# Altium schematic sheet XMOS_chip.SchDoc
size Tabloid; DocumentNumber: 5; SheetNumber: 5; SheetTotal: 11; SheetName: XMOS processor
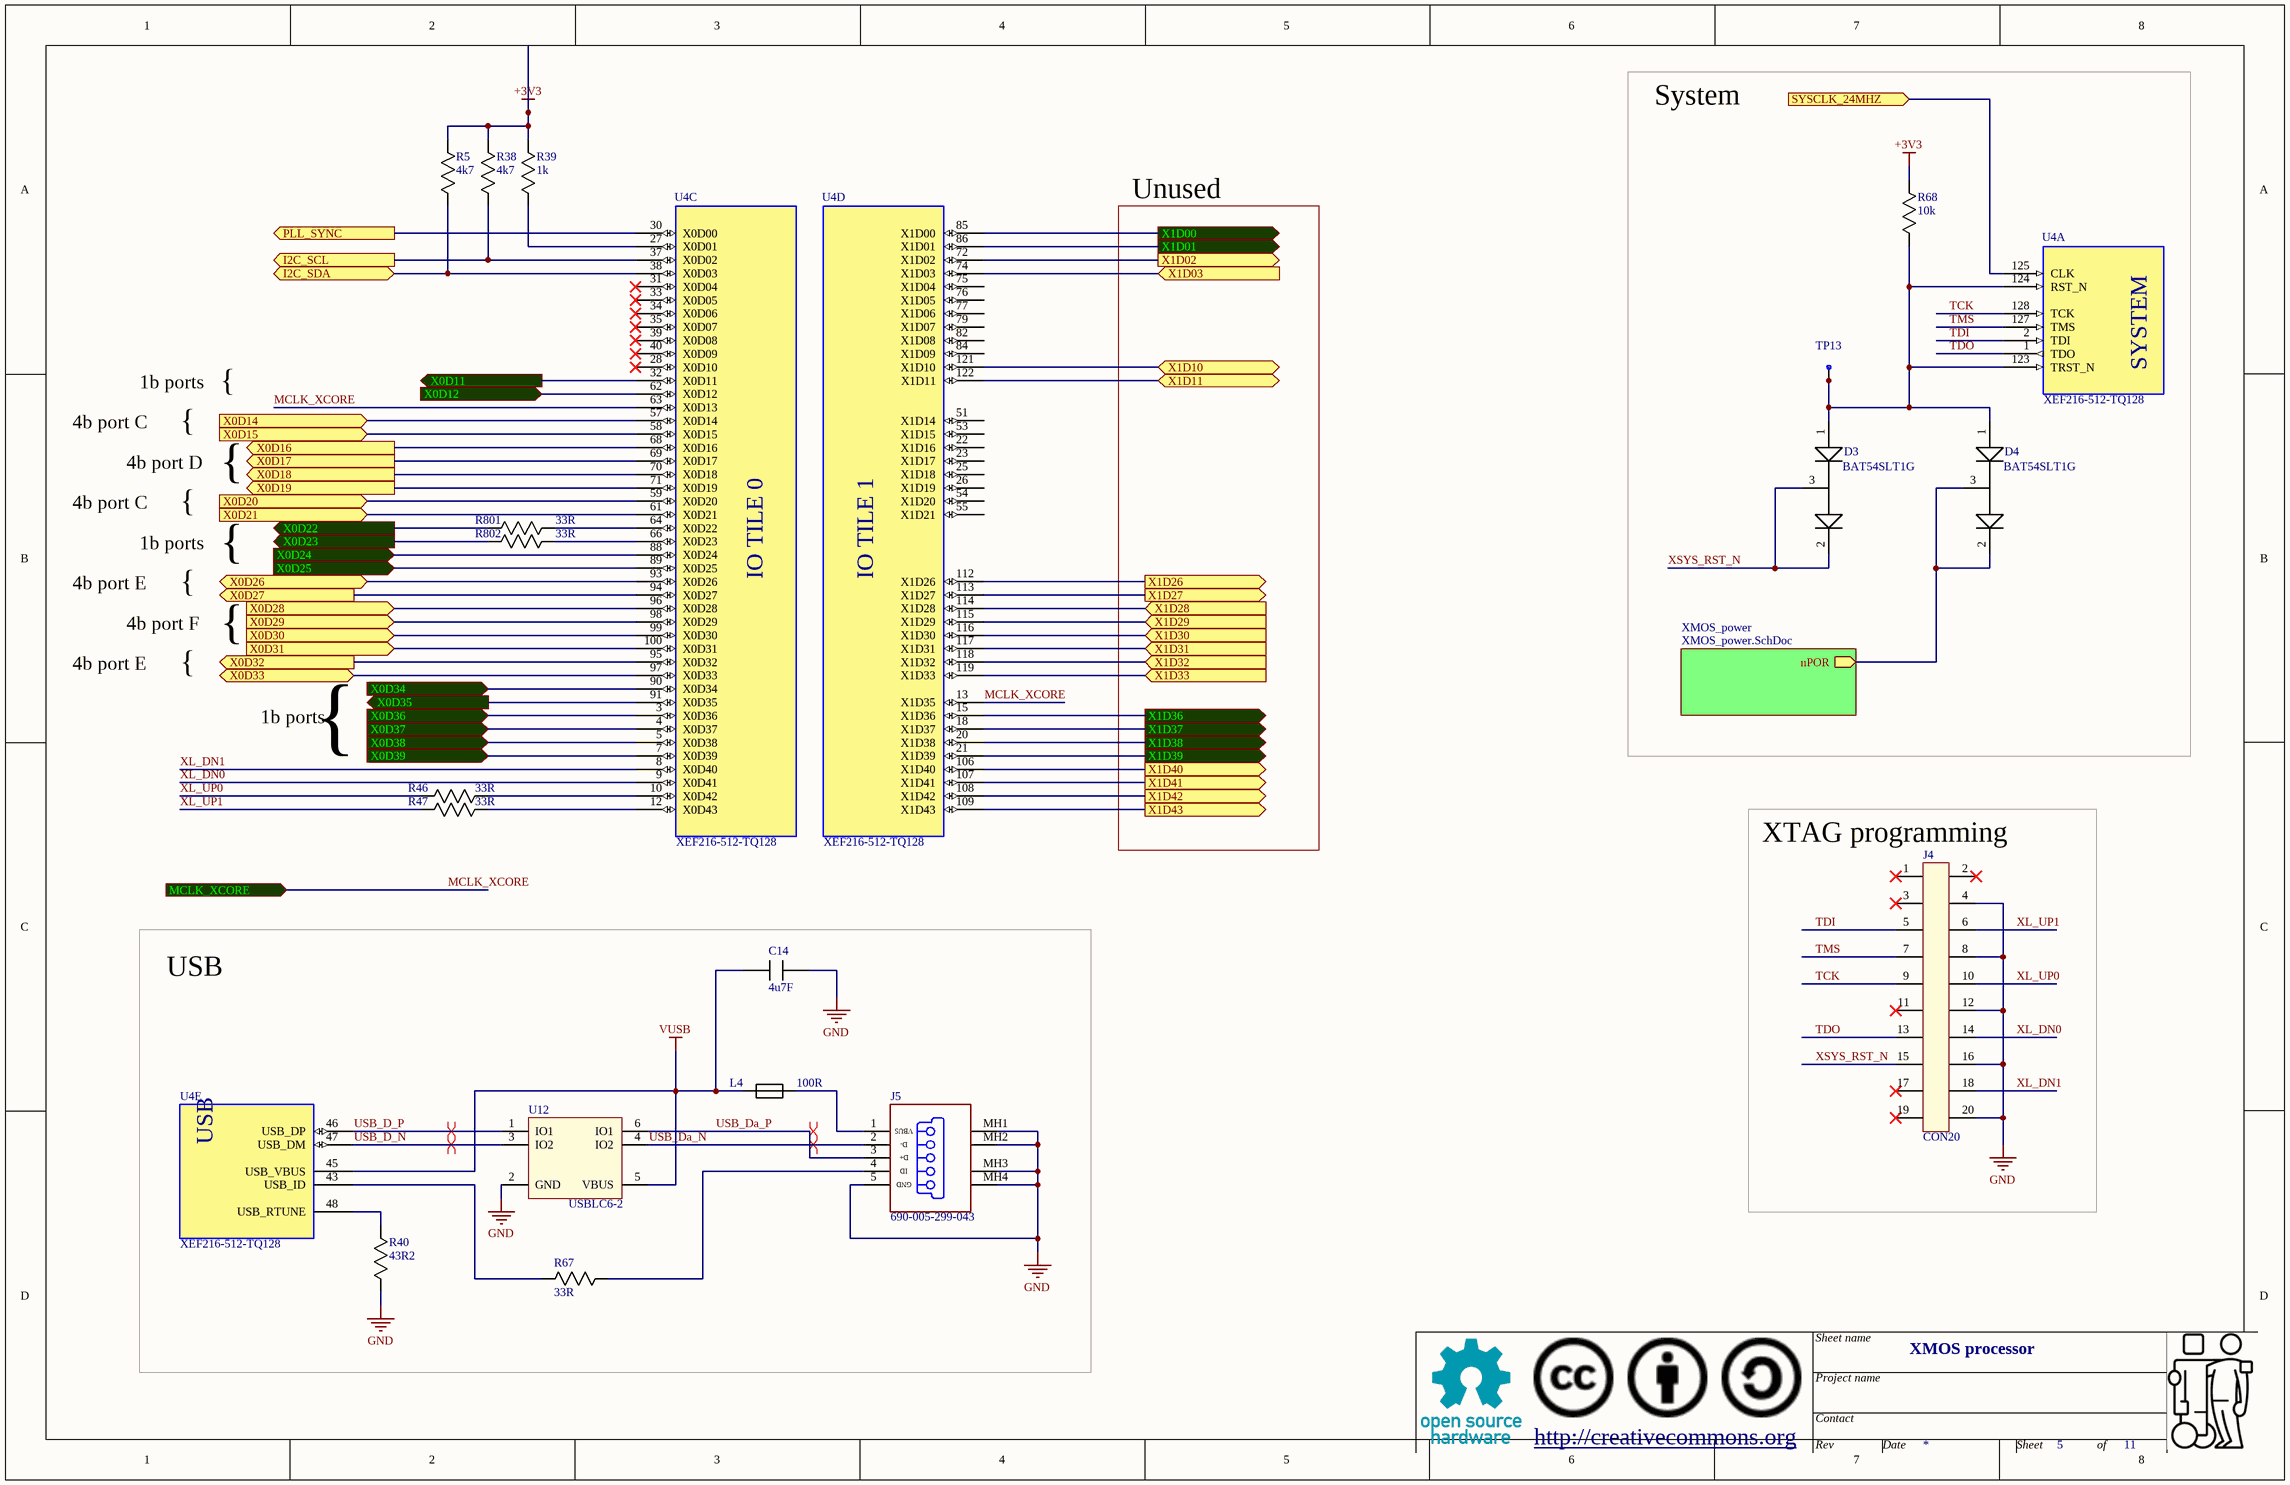
[diagram p0: XMOS_chip.SchDoc]

## Parts
C14  value 4u7F  [0805]  (hidden comment: Capacitor)
D3  Mfg_PN: BAT54SLT1G  [SOT23_132]  (hidden comment: Diode_dual)
D4  Mfg_PN: BAT54SLT1G  [SOT23_132]  (hidden comment: Diode_dual)
J4  CON20  [CONN20_100mils_pol_SMD]
J5  Mfg_PN: 690-005-299-043  [CONN_USB_MINIB_690-005-299-043]  (hidden comment: USB_MINIB_690-005-299-043)
L4  value 100R  [0805]  (hidden comment: Ferrite)
R5  value 4k7  [0603]  (hidden comment: Resistor)
R38  value 4k7  [0603]  (hidden comment: Resistor)
R39  value 1k  [0603]  (hidden comment: Resistor)
R40  value 43R2  [0603]  (hidden comment: Resistor)
R46  value 33R  [0603]  (hidden comment: Resistor)
R47  value 33R  [0603]  (hidden comment: Resistor)
R67  value 33R  [0603]  (hidden comment: Resistor)
R68  value 10k  [0603]  (hidden comment: Resistor)
R801  value 33R  [0603]  (hidden comment: Resistor)
R802  value 33R  [0603]  (hidden comment: Resistor)
TP13  TESTPOINT  [0603]  (value not drawn)
U4  Mfg_PN: XEF216-512-TQ128  [TQFP128_XMOS]  (parts A,C,D,E of 5)
U12  USBLC6-2  [USBLC6-2]

## Blocks framed on the sheet
System: D3 D4 R68 TP13 U4
XTAG programming: J4
USB: C14 J5 L4 R40 R67 U4 U12

## Sub-sheets
XMOS_power = XMOS_power.SchDoc: nPOR (out)

## Ports
I2C_SCL (out), I2C_SDA (bidir), MCLK_XCORE (in), PLL_SYNC (out), SYSCLK_24MHZ (in), X0D11 (out), X0D12 (in), X0D14 (in), X0D15 (in), X0D16 (out), X0D17 (out), X0D18 (out), X0D19 (out), X0D20 (in), X0D21 (in), X0D22 (out), X0D23 (out), X0D24 (in), X0D25 (in), X0D26 (bidir), X0D27 (out), X0D28 (in), X0D29 (in), X0D30 (in), X0D31 (in), X0D32 (out), X0D33 (bidir), X0D34 (in), X0D35 (out), X0D36 (in), X0D37 (in), X0D38 (in), X0D39 (in), X1D00 (out), X1D01 (out), X1D02 (out), X1D03 (in), X1D10 (bidir), X1D11 (bidir), X1D26 (out), X1D27 (out), X1D28 (in), X1D29 (in), X1D30 (in), X1D31 (in), X1D32 (in), X1D33 (in), X1D36 (out), X1D37 (out), X1D38 (out), X1D39 (out), X1D40 (out), X1D41 (out), X1D42 (out), X1D43 (out)

## Nets
+3V3: R5.1 R38.1 R39.1 R68.1
GND: C14.2 J4.4 J4.8 J4.12 J4.16 J4.20 J5.5(GND) J5.MH1(Tab) J5.MH2(Tab) J5.MH3(Tab) J5.MH4(Tab) R40.1 U12.2(GND)
VUSB: C14.1 L4.1 U4.45(USB_VBUS) U12.5(VBUS)
I2C_SCL: R38.2 U4.37(X0D02) ; port I2C_SCL
I2C_SDA: R5.2 U4.38(X0D03) ; port I2C_SDA
MCLK_XCORE: U4.13(X1D35) U4.63(X0D13) ; port MCLK_XCORE
PLL_SYNC: U4.30(X0D00) ; port PLL_SYNC
SYSCLK_24MHZ: U4.125(CLK) ; port SYSCLK_24MHZ
TCK: J4.9 U4.128(TCK)
TDI: J4.5 U4.2(TDI)
TDO: J4.13 U4.1(TDO)
TMS: J4.7 U4.127(TMS)
USB_D_N: U4.47(USB_DM) U12.3(IO2)
USB_D_P: U4.46(USB_DP) U12.1(IO1)
USB_Da_N: J5.2(D-) U12.4(IO2)
USB_Da_P: J5.3(D+) U12.6(IO1)
X0D11: U4.32(X0D11) ; port X0D11
X0D12: U4.62(X0D12) ; port X0D12
X0D14: U4.57(X0D14) ; port X0D14
X0D15: U4.58(X0D15) ; port X0D15
X0D16: U4.68(X0D16) ; port X0D16
X0D17: U4.69(X0D17) ; port X0D17
X0D18: U4.70(X0D18) ; port X0D18
X0D19: U4.71(X0D19) ; port X0D19
X0D20: U4.59(X0D20) ; port X0D20
X0D21: U4.61(X0D21) ; port X0D21
X0D22: R801.1 ; port X0D22
X0D23: R802.1 ; port X0D23
X0D24: U4.88(X0D24) ; port X0D24
X0D25: U4.89(X0D25) ; port X0D25
X0D26: U4.93(X0D26) ; port X0D26
X0D27: U4.94(X0D27) ; port X0D27
X0D28: U4.96(X0D28) ; port X0D28
X0D29: U4.98(X0D29) ; port X0D29
X0D30: U4.99(X0D30) ; port X0D30
X0D31: U4.100(X0D31) ; port X0D31
X0D32: U4.95(X0D32) ; port X0D32
X0D33: U4.97(X0D33) ; port X0D33
X0D34: U4.90(X0D34) ; port X0D34
X0D35: U4.91(X0D35) ; port X0D35
X0D36: U4.3(X0D36) ; port X0D36
X0D37: U4.4(X0D37) ; port X0D37
X0D38: U4.5(X0D38) ; port X0D38
X0D39: U4.7(X0D39) ; port X0D39
X1D00: U4.85(X1D00) ; port X1D00
X1D01: U4.86(X1D01) ; port X1D01
X1D02: U4.72(X1D02) ; port X1D02
X1D03: U4.74(X1D03) ; port X1D03
X1D10: U4.121(X1D10) ; port X1D10
X1D11: U4.122(X1D11) ; port X1D11
X1D26: U4.112(X1D26) ; port X1D26
X1D27: U4.113(X1D27) ; port X1D27
X1D28: U4.114(X1D28) ; port X1D28
X1D29: U4.115(X1D29) ; port X1D29
X1D30: U4.116(X1D30) ; port X1D30
X1D31: U4.117(X1D31) ; port X1D31
X1D32: U4.118(X1D32) ; port X1D32
X1D33: U4.119(X1D33) ; port X1D33
X1D36: U4.15(X1D36) ; port X1D36
X1D37: U4.18(X1D37) ; port X1D37
X1D38: U4.20(X1D38) ; port X1D38
X1D39: U4.21(X1D39) ; port X1D39
X1D40: U4.106(X1D40) ; port X1D40
X1D41: U4.107(X1D41) ; port X1D41
X1D42: U4.108(X1D42) ; port X1D42
X1D43: U4.109(X1D43) ; port X1D43
XL_DN0: J4.14 U4.9(X0D41)
XL_DN1: J4.18 U4.8(X0D40)
XL_UP0: J4.10 R46.1
XL_UP1: J4.6 R47.1
XSYS_RST_N: D3.2(K) D3.3(AK) J4.15
NetD3_1: D3.1(K) D4.1(K) R68.2 TP13.1 TP13.2 U4.123(TRST_N) U4.124(RST_N)
NetD4_2: D4.2(K) D4.3(AK) ; sheet XMOS_power/nPOR
NetJ5_1: J5.1(V_BUS_(5V)) L4.2
NetJ5_4: J5.4(NC) R67.1
NetR39_2: R39.2 U4.27(X0D01)
NetR40_2: R40.2 U4.48(USB_RTUNE)
NetR46_2: R46.2 U4.10(X0D42)
NetR47_2: R47.2 U4.12(X0D43)
NetR67_2: R67.2 U4.43(USB_ID)
NetR801_2: R801.2 U4.64(X0D22)
NetR802_2: R802.2 U4.66(X0D23)

Not connected (* = marked no-connect by the designer): J4 1* 2* 3* 11* 17* 19*; U4 22(X1D16) 23(X1D17) 25(X1D18) 26(X1D19) 28(X0D10)* 31(X0D04)* 33(X0D05)* 34(X0D06)* 35(X0D07)* 39(X0D08)* 40(X0D09)* 51(X1D14) 53(X1D15) 54(X1D20) 55(X1D21) 75(X1D04) 76(X1D05) 77(X1D06) 79(X1D07) 82(X1D08) 84(X1D09)

## Layout directives
differential pair: USB_D_N, USB_D_P, USB_Da_N, USB_Da_P

## Notes on the sheet
- Unused
- 4b port C
- 1b ports
- {
- 4b port D
- 4b port E
- 4b port F
- Sheet name
- http://creativecommons.org
- Project name
- Contact
- Rev
- Date
- Sheet
- of
- (in symbol USB_MINIB_690-005-299-043) VBUS; ID
- (in symbol XMOS_XEF216-512-TQ128, part A) SYSTEM
- (in symbol XMOS_XEF216-512-TQ128, part C) IO TILE 0
- (in symbol XMOS_XEF216-512-TQ128, part D) IO TILE 1
- (in symbol XMOS_XEF216-512-TQ128, part E) USB

## Library data of the parts
C14 = Capacitor: Mfg: Samsung; Mfg_PN: CL21A475KAQNNNG; HelpURL: *; NI: *; Supplier1: Digikey; Supplier1_PN: 1276-6462-1-ND; Tolerance: *; Type: *; Rating: *
D3 D4 = Diode_dual: Diode; Mfg: Onsemi; HelpURL: *; NI: *; Supplier1: Digikey; Supplier1_PN: BAT54SLT1GOSCT-ND; Tolerance: *; Type: *; Rating: *; Value: *
J4 = CON20: 20-pins; Mfg: CNC Tech; Mfg_PN: 3020-20-0300-00; HelpURL: *; NI: *; Rating: *; Supplier1: Digikey; Supplier1_PN: 1175-1623-ND; Tolerance: *; Type: *; Value: *
J5 = USB_MINIB_690-005-299-043: USB On-The-Go (OTG) Mini-B Receptacle, Right Angle, SMT, 0.80mm (.031") Pitch, Solder Tabs with Back Cover, Recessed Type; Mfg: EDAC; Supplier1: Digikey; Supplier1_PN: 151-1206-1-ND
L4 = Ferrite: Mfg: Bourns; Mfg_PN: MH2029-101Y; Rating: 1A; HelpURL: *; NI: *; Supplier1: Digikey; Supplier1_PN: MH2029-101YCT-ND; Tolerance: *; Type: *
R5 R38 = Resistor: Mfg: Yageo; Mfg_PN: RC0603JR-074K7L; HelpURL: *; NI: *; Supplier1: Digikey; Supplier1_PN: 311-4.7KGRCT-ND; Type: *; Rating: *; Tolerance: *
R39 = Resistor: Mfg: Yageo; Mfg_PN: RC0603JR-071KL; HelpURL: *; NI: *; Supplier1: Digikey; Supplier1_PN: 311-1.0KGRCT-ND; Type: *; Rating: *; Tolerance: *
R40 = Resistor: Mfg: Yageo; Mfg_PN: RC0603FR-0743R2L; HelpURL: *; NI: *; Supplier1: Digikey; Supplier1_PN: 311-43.2HRCT-ND; Type: *; Rating: *; Tolerance: *
R46 R47 R67 R801 R802 = Resistor: Mfg: Yageo; Mfg_PN: RC0603JR-0733RL; HelpURL: *; NI: *; Supplier1: Digikey; Supplier1_PN: 311-33GRCT-ND; Type: *; Rating: *; Tolerance: *
R68 = Resistor: Mfg: Yageo; Mfg_PN: RC0603JR-0710KL; HelpURL: *; NI: *; Supplier1: Digikey; Supplier1_PN: 311-10KGRCT-ND; Type: *; Rating: *; Tolerance: *
TP13 = TESTPOINT: Test point; Mfg: TE; Mfg_PN: RCU-0C; HelpURL: *; NI: *; Rating: *; Supplier1: Digikey; Supplier1_PN: A106145CT-ND; Tolerance: *; Type: *; Value: *
U4 = XMOS_XEF216-512-TQ128: 32-bit multicore microcontroller. 2 Tiles. 16 Logical Cores. 512KB SRAM. 1000MIPS. TQFP128.; Mfg: XMOS; Supplier1: Digikey; Supplier1_PN: 880-1100-ND
U12 = USBLC6-2: USB overvoltage protection; Mfg: ST; HelpURL: http://www.st.com/web/en/resource/technical/document/datasheet/CD00050750.pdf; Mfg_PN: USBLC6-2; NI: *; Supplier1: Digikey; Supplier1_PN: 497-5026-2-ND; Type: *